# EAGLE design DASHBOARD (EAGLE 9.1.3)
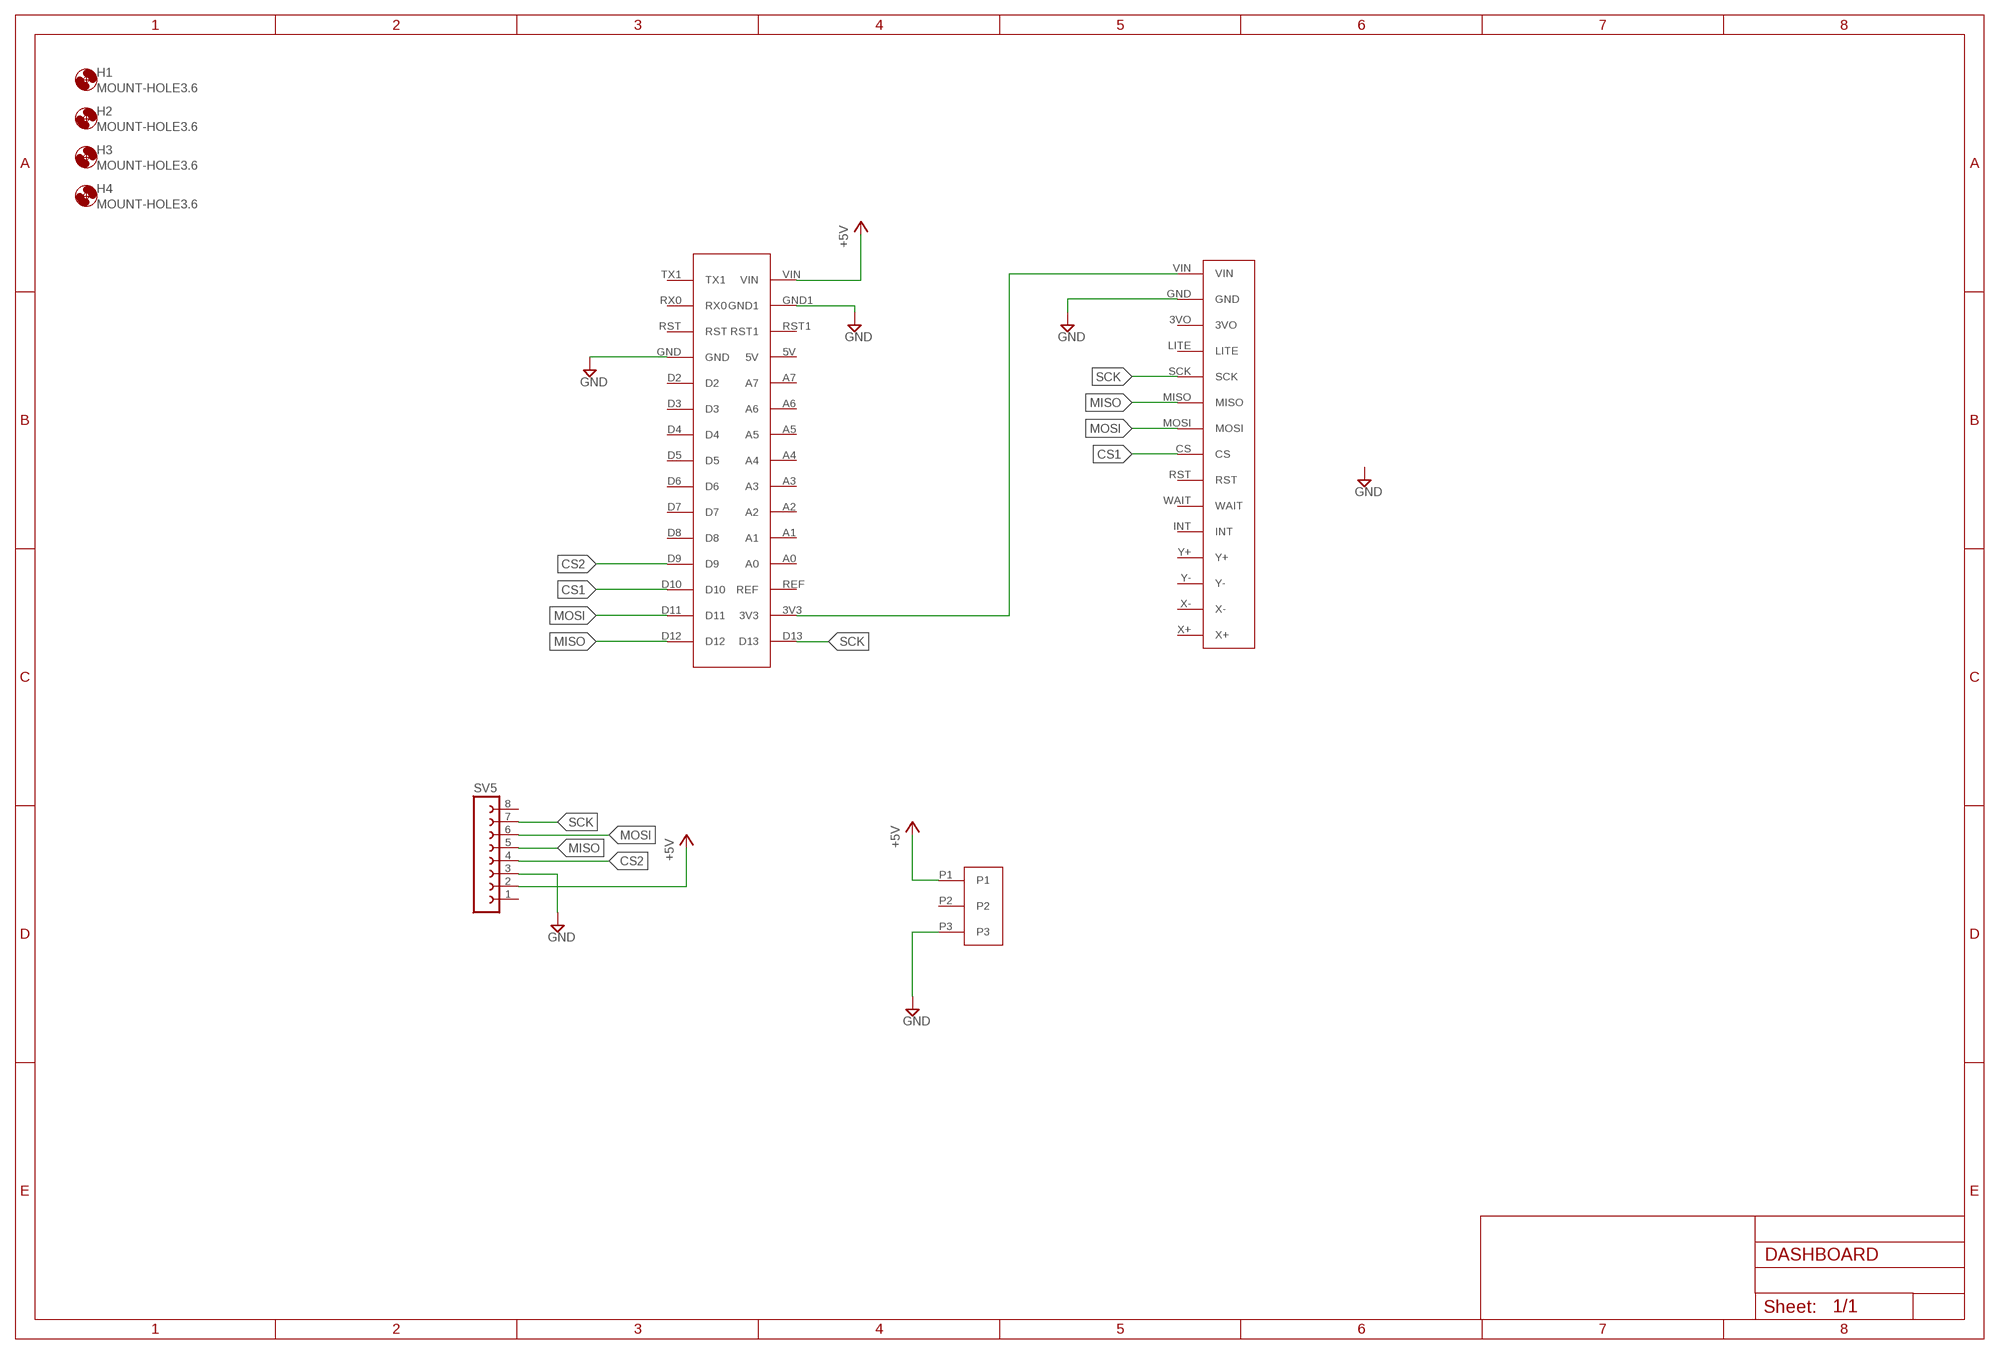
[diagram p0: schematic, sheet 1]

## Parts
H1  MOUNT-HOLE3.6  [3,6]
H2  MOUNT-HOLE3.6  [3,6]
H3  MOUNT-HOLE3.6  [3,6]
H4  MOUNT-HOLE3.6  [3,6]
SV5  FE08-1  [FE08]
U$1  BREAKOUT  [BREAKOUT]
U$2  NANO  [NANO]
U$3  1935789  [1935789]

## Nets
CS1: U$1.CS U$2.D10
CS2: SV5.4 U$2.D9
GND [SIG]: SV5.3 U$1.GND U$2.GND U$2.GND1 U$3.P3
MISO: SV5.5 U$1.MISO U$2.D12
MOSI: SV5.6 U$1.MOSI U$2.D11
N$1: U$1.VIN U$2.3V3
N$50: SV5.2 U$2.VIN U$3.P1 ; supply symbol labelled +5V
SCK: SV5.7 U$1.SCK U$2.D13
Unconnected: SV5.1 SV5.8 U$1.3VO U$1.INT U$1.LITE U$1.RST U$1.WAIT U$1.X+ U$1.X- U$1.Y+ U$1.Y- U$2.5V U$2.A0 U$2.A1 U$2.A2 U$2.A3 U$2.A4 U$2.A5 U$2.A6 U$2.A7 U$2.D2 U$2.D3 U$2.D4 U$2.D5 U$2.D6 U$2.D7 U$2.D8 U$2.REF U$2.RST U$2.RST1 U$2.RX0 U$2.TX1 U$3.P2

## Library data of the parts
H1-H4 = holes:MOUNT-HOLE: MOUNTING HOLE with drill center marker
SV5 = con-lsta:FE08-1: FEMALE HEADER; OC_FARNELL: unknown; OC_NEWARK: unknown
U$1 = DASHBOARD:BREAKOUT
U$2 = DASHBOARD:NANO
U$3 = 111FANCTRL:1935789

## Net classes
0 RAIL1: width 0.4 mm, drill 0.5 mm, clearance 0.1 mm
1 HV: width 0.5 mm, drill 0.15 mm, clearance 0.1 mm

## Board
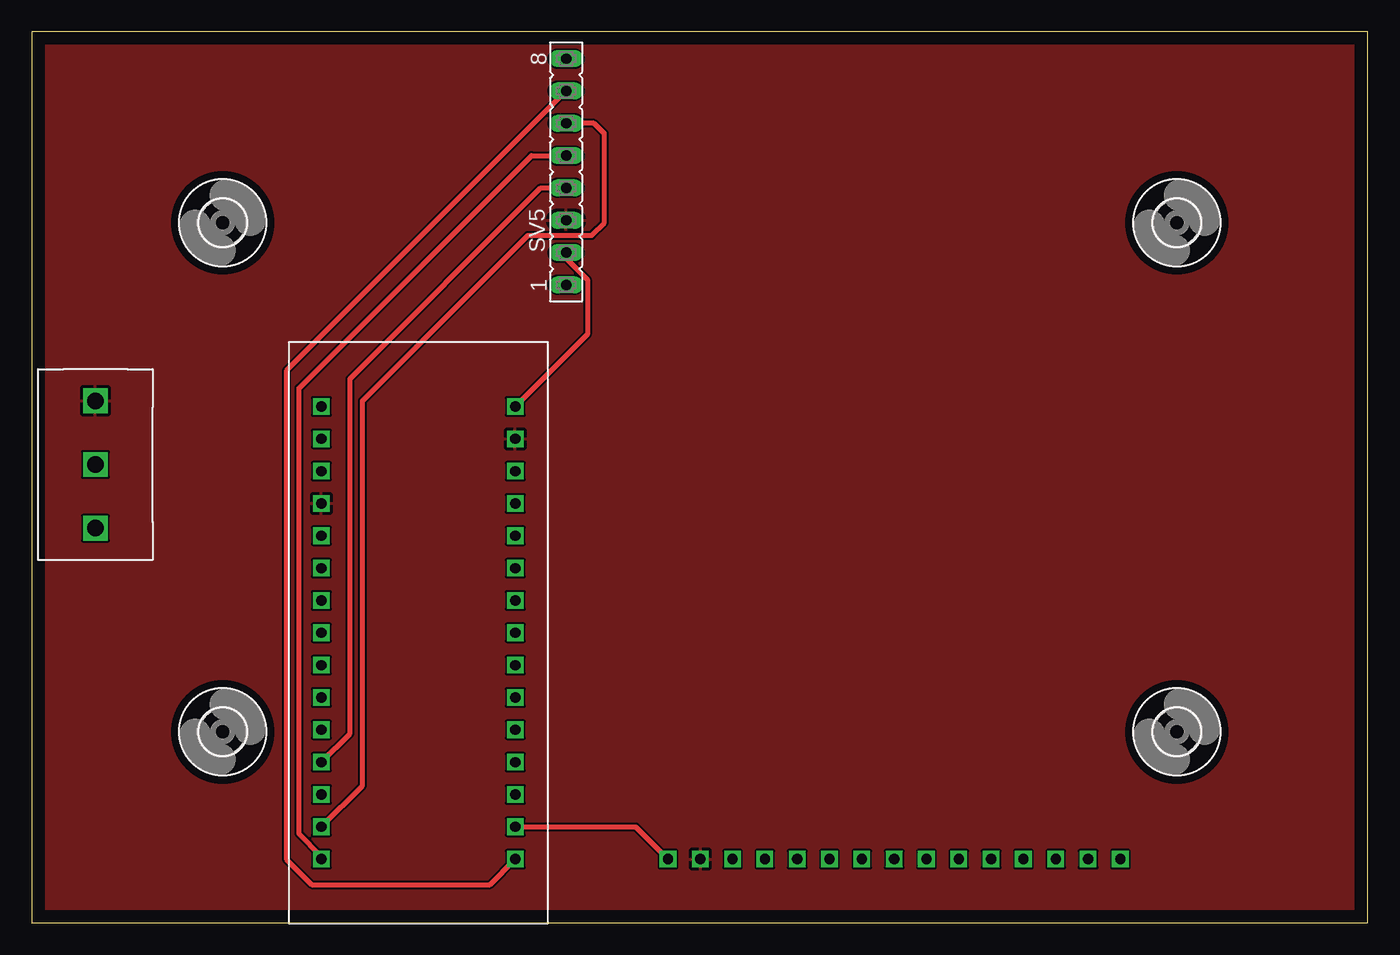
[diagram p1: board, top side]
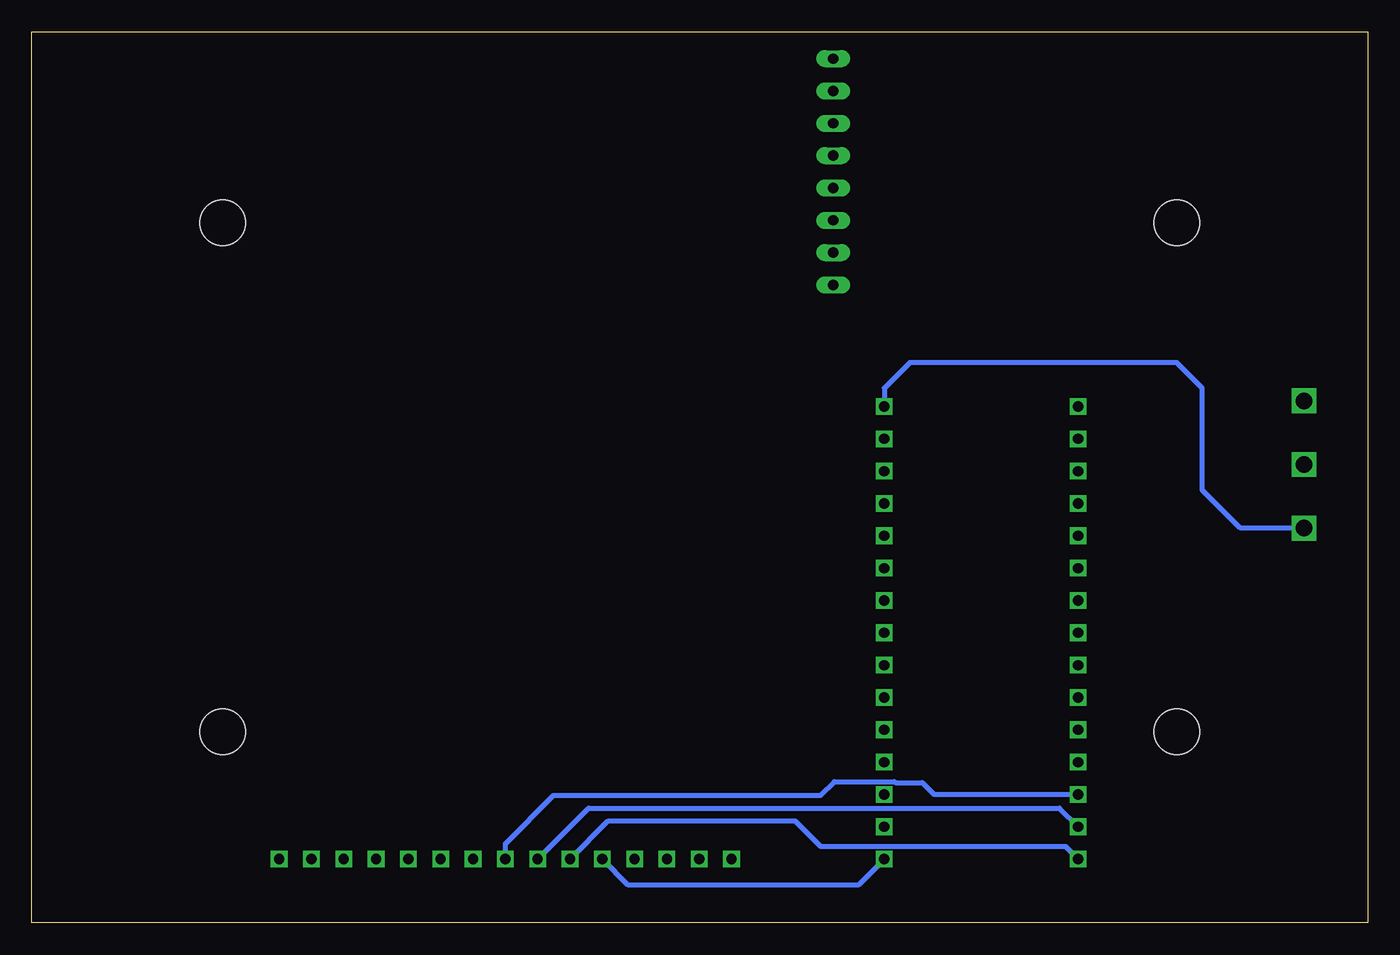
[diagram p2: board, bottom side, seen from below]

Size 105 x 70 mm. Coordinates in mm from the lower left corner, seen from the top.
Outline: 0,0 105,0 105,70 0,70 0,0
Copper layers (1*16): Top 0.035mm / dielectric 1.5mm / Bottom 0.035mm
Design rules "default": minimum track width 6mil, minimum drill 0.35mm, track to track 6mil, track to pad 6mil, pad to pad 6mil, via to via 6mil, smd to smd 6mil, copper to edge 40mil, drill to drill 6mil, minimum pad ring 10mil, minimum via ring 8mil, stop-mask expansion 4mil, vias tented up to drill 0mil, thermal gap 10mil

### Footprints (pad centres in the part's own frame; a part is rotated, then mirrored left to right if it is on the bottom)
3,6 = hole 3.6: 0,0
FE08 = drill 0.813 long: 1 -8.89,0; 2 -6.35,0; 3 -3.81,0; 4 -1.27,0; 5 1.27,0; 6 3.81,0; 7 6.35,0; 8 8.89,0
BREAKOUT = drill 0.8 square: 3VO 5.08,0; CS 17.78,0; GND 2.54,0; INT 25.4,0; LITE 7.62,0; MISO 12.7,0; MOSI 15.24,0; RST 20.32,0; SCK 10.16,0; VIN 0,0; WAIT 22.86,0; X+ 35.56,0; X- 33.02,0; Y+ 27.94,0; Y- 30.48,0
NANO = drill 0.8 square: 3V3 2.54,0; 5V 27.94,0; A0 7.62,0; A1 10.16,0; A2 12.7,0; A3 15.24,0; A4 17.78,0; A5 20.32,0; A6 22.86,0; A7 25.4,0; D2 25.4,15.24; D3 22.86,15.24; D4 20.32,15.24; D5 17.78,15.24; D6 15.24,15.24; D7 12.7,15.24; D8 10.16,15.24; D9 7.62,15.24; D10 5.08,15.24; D11 2.54,15.24; D12 0,15.24; D13 0,0; GND 27.94,15.24; GND1 33.02,0; REF 5.08,0; RST 30.48,15.24; RST1 30.48,0; RX0 33.02,15.24; TX1 35.56,15.24; VIN 35.56,0
1935789 = drill 1.3 square: P1 -5,0; P2 0,0; P3 5,0

### Placement (x,y rotation side)
H1  15,15 0 top
H2  15,55 0 top
H3  90,15 0 top
H4  90,55 0 top
SV5  42,59 90 top
U$1  50,5 0 top
U$2  38,5 90 top
U$3  5,36 90 top

### Tracks (layer width: path | path; a pad name or v marks a point on that pad's centre or on a via)
CS1
  Bottom 0.4: U$1.CS 67.78,6.22 64,10 43,10 41.91,11.09 37.2,11.09 37.11,11 35,11 34.08,10.08 U$2.D10
CS2
  Top 0.4: U$2.D9 25,14.86 25,42.73 40,57.73 SV5.4
GND
  pour Top: 0,70 0,0 105,0 105,70
MISO
  Top 0.4: U$2.D12 22.76,5.24 21,7 21,42 39.27,60.27 SV5.5
  Bottom 0.4: U$1.MISO 59.7,8 45,8 43,6 38.81,6 38.8,6.01 37.2,6.01 37.19,6 23.76,6 U$2.D12
MOSI
  Top 0.4: U$2.D11 26,10.78 26,18 | 26,18 26,41 39,54 44,54 45,55 45,62 44.19,62.81 SV5.6 | 26,18
  Bottom 0.4: U$1.MOSI 61.24,9 24.22,9 U$2.D11
N$1
  Top 0.4: U$2.3V3 47.46,7.54 U$1.VIN
N$50
  Top 0.4: SV5.2 42,52.2 43.67,50.53 43.67,46.23 U$2.VIN
  Bottom 0.4: U$3.P1 10,31 13,34 13,42 15,44 36,44 38,42 U$2.VIN
SCK
  Top 0.4: SV5.7 20,43.35 20,5 22,3 36,3 U$2.D13
  Bottom 0.4: U$1.SCK 58.16,3 40,3 U$2.D13
(copper drawn outside any net)
  shapes: Top area x2